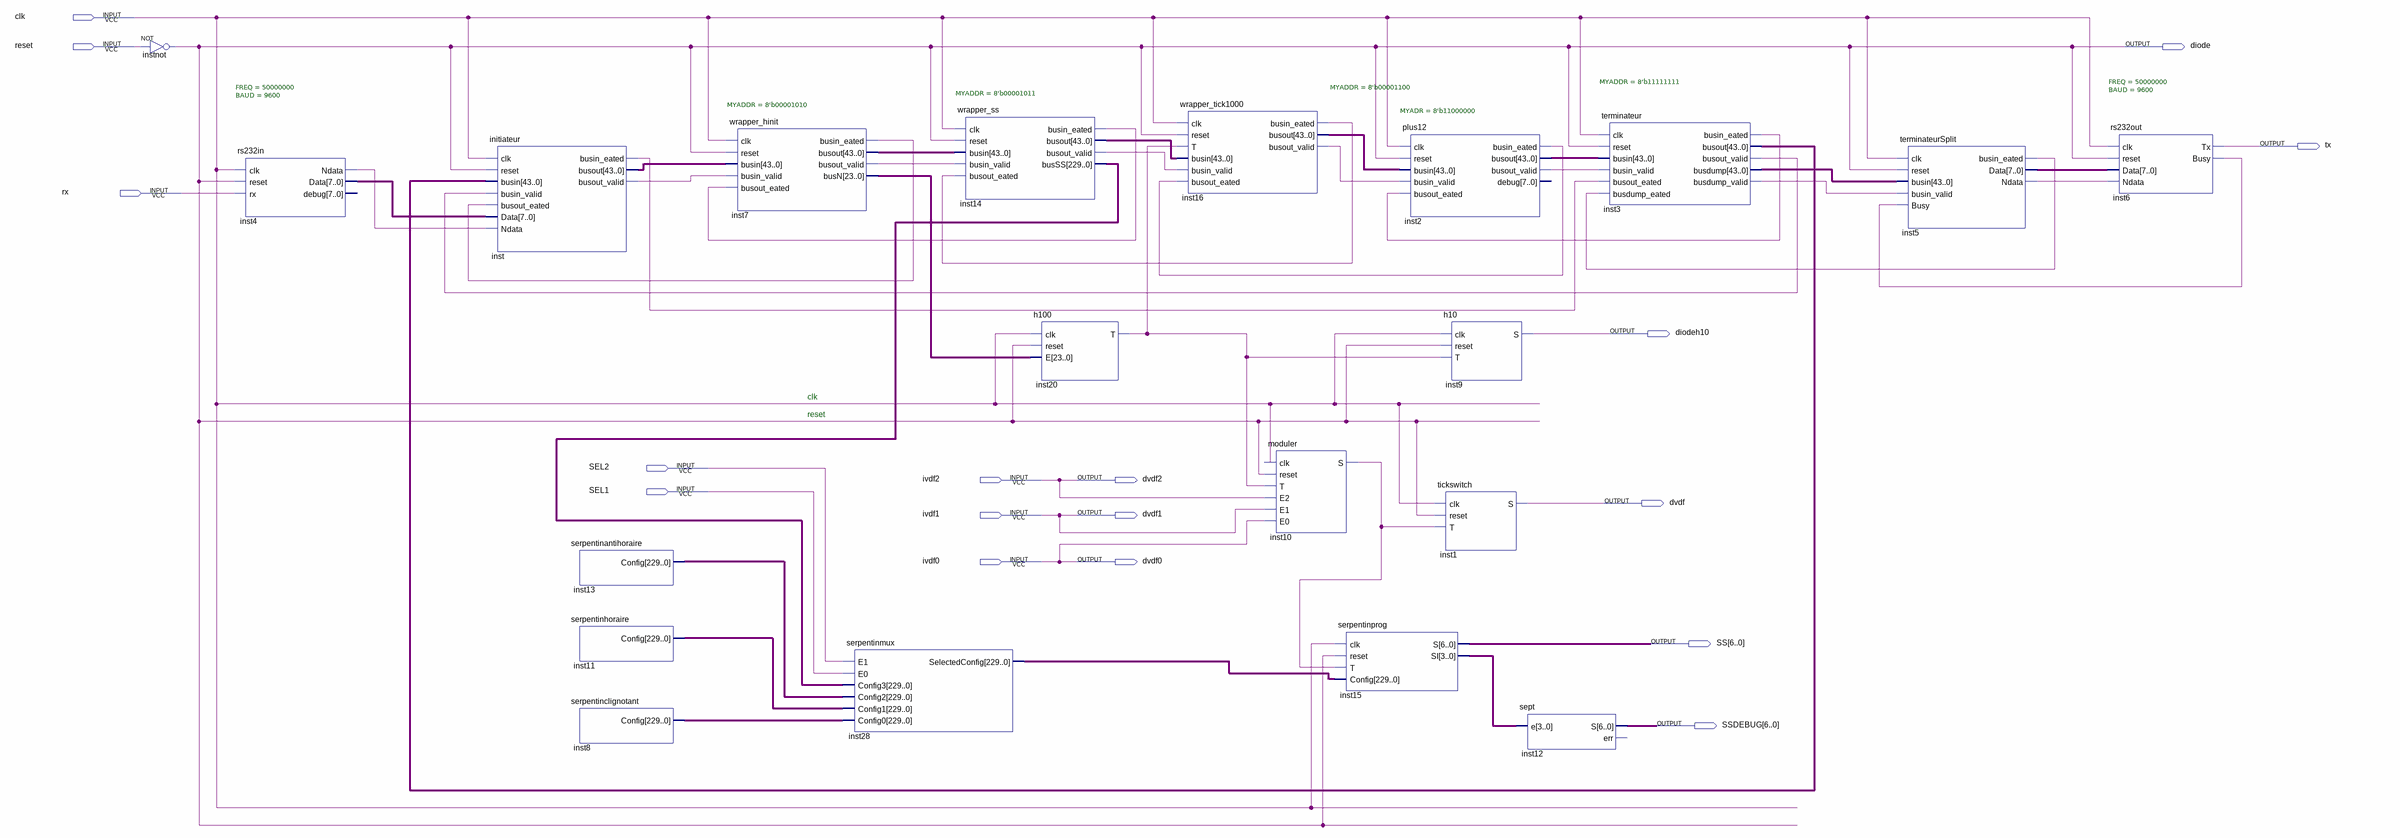
[diagram p0: schematic sheet]
// Quartus schematic bus_ia.bdf as structural Verilog: 20 symbols, 17 pins
module bus_ia (
  input  clk,
  input  reset,
  input  rx,
  input  SEL2,
  input  ivdf2,
  input  SEL1,
  input  ivdf1,
  input  ivdf0,
  output diode,
  output tx,
  output diodeh10,
  output dvdf2,
  output dvdf,
  output dvdf1,
  output dvdf0,
  output [6:0] SS,
  output [6:0] SSDEBUG
);

  wire inst2_busin_eated, inst2_busout_valid, inst3_busdump_valid, inst3_busin_eated, inst3_busout_valid,
       inst4_ndata, inst5_busin_eated, inst5_ndata, inst6_busy, inst7_busin_eated, inst7_busout_valid,
       inst10_s, inst14_busin_eated, inst14_busout_valid, inst16_busin_eated, inst16_busout_valid, inst20_t,
       inst_busin_eated, inst_busout_valid;
  wire [3:0] inst15_si;
  wire [7:0] inst4_data, inst5_data;
  wire [23:0] inst7_busn;
  wire [43:0] inst2_busout, inst3_busdump, inst3_busout, inst7_busout, inst14_busout, inst16_busout,
       inst_busout;
  wire [229:0] inst8_config, inst11_config, inst13_config, inst14_busss, inst28_selectedconfig;

  not instnot (diode, reset);
  rs232in #(.FREQ(50000000), .BAUD(9600)) inst4 (
    .clk(clk), .reset(diode), .rx(rx), .Ndata(inst4_ndata), .Data(inst4_data));  // open: debug
  initiateur inst (
    .clk(clk), .reset(diode), .busin(inst3_busout), .busin_valid(inst3_busout_valid),
    .busout_eated(inst7_busin_eated), .Data(inst4_data), .Ndata(inst4_ndata), .busin_eated(inst_busin_eated),
    .busout(inst_busout), .busout_valid(inst_busout_valid));
  serpentinantihoraire inst13 (.Config(inst13_config));
  serpentinhoraire inst11 (.Config(inst11_config));
  serpentinclignotant inst8 (.Config(inst8_config));
  wrapper_hinit #(.MYADDR(8'b00001010)) inst7 (
    .clk(clk), .reset(diode), .busin(inst_busout), .busin_valid(inst_busout_valid),
    .busout_eated(inst14_busin_eated), .busin_eated(inst7_busin_eated), .busout(inst7_busout),
    .busout_valid(inst7_busout_valid), .busN(inst7_busn));
  serpentinmux inst28 (
    .E1(SEL2), .E0(SEL1), .Config3(inst14_busss), .Config2(inst13_config), .Config1(inst11_config),
    .Config0(inst8_config), .SelectedConfig(inst28_selectedconfig));
  wrapper_ss #(.MYADDR(8'b00001011)) inst14 (
    .clk(clk), .reset(diode), .busin(inst7_busout), .busin_valid(inst7_busout_valid),
    .busout_eated(inst16_busin_eated), .busin_eated(inst14_busin_eated), .busout(inst14_busout),
    .busout_valid(inst14_busout_valid), .busSS(inst14_busss));
  h100 inst20 (.clk(clk), .reset(diode), .E(inst7_busn), .T(inst20_t));
  wrapper_tick1000 #(.MYADDR(8'b00001100)) inst16 (
    .clk(clk), .reset(diode), .T(inst20_t), .busin(inst14_busout), .busin_valid(inst14_busout_valid),
    .busout_eated(inst2_busin_eated), .busin_eated(inst16_busin_eated), .busout(inst16_busout),
    .busout_valid(inst16_busout_valid));
  moduler inst10 (.clk(clk), .reset(diode), .T(inst20_t), .E2(ivdf2), .E1(ivdf1), .E0(ivdf0), .S(inst10_s));
  serpentinprog inst15 (.clk(clk), .reset(diode), .T(inst10_s), .Config(inst28_selectedconfig), .S(SS), .SI(inst15_si));
  plus12 #(.MYADR(8'b11000000)) inst2 (
    .clk(clk), .reset(diode), .busin(inst16_busout), .busin_valid(inst16_busout_valid),
    .busout_eated(inst3_busin_eated), .busin_eated(inst2_busin_eated), .busout(inst2_busout),
    .busout_valid(inst2_busout_valid));  // open: debug
  h10 inst9 (.clk(clk), .reset(diode), .T(inst20_t), .S(diodeh10));
  tickswitch inst1 (.clk(clk), .reset(diode), .T(inst10_s), .S(dvdf));
  sept inst12 (.e(inst15_si), .S(SSDEBUG));  // open: err
  terminateur #(.MYADDR(8'b11111111)) inst3 (
    .clk(clk), .reset(diode), .busin(inst2_busout), .busin_valid(inst2_busout_valid),
    .busout_eated(inst_busin_eated), .busdump_eated(inst5_busin_eated), .busin_eated(inst3_busin_eated),
    .busout(inst3_busout), .busout_valid(inst3_busout_valid), .busdump(inst3_busdump),
    .busdump_valid(inst3_busdump_valid));
  terminateurSplit inst5 (
    .clk(clk), .reset(diode), .busin(inst3_busdump), .busin_valid(inst3_busdump_valid), .Busy(inst6_busy),
    .busin_eated(inst5_busin_eated), .Data(inst5_data), .Ndata(inst5_ndata));
  rs232out #(.FREQ(50000000), .BAUD(9600)) inst6 (
    .clk(clk), .reset(diode), .Data(inst5_data), .Ndata(inst5_ndata), .Tx(tx), .Busy(inst6_busy));

  assign dvdf0 = ivdf0;
  assign dvdf1 = ivdf1;
  assign dvdf2 = ivdf2;

  // Notes on the sheet:
  //   clk
  //   reset
endmodule
